# EAGLE board SparkFun_Thing_Plus_RA6M5 (EAGLE 9.6.2)
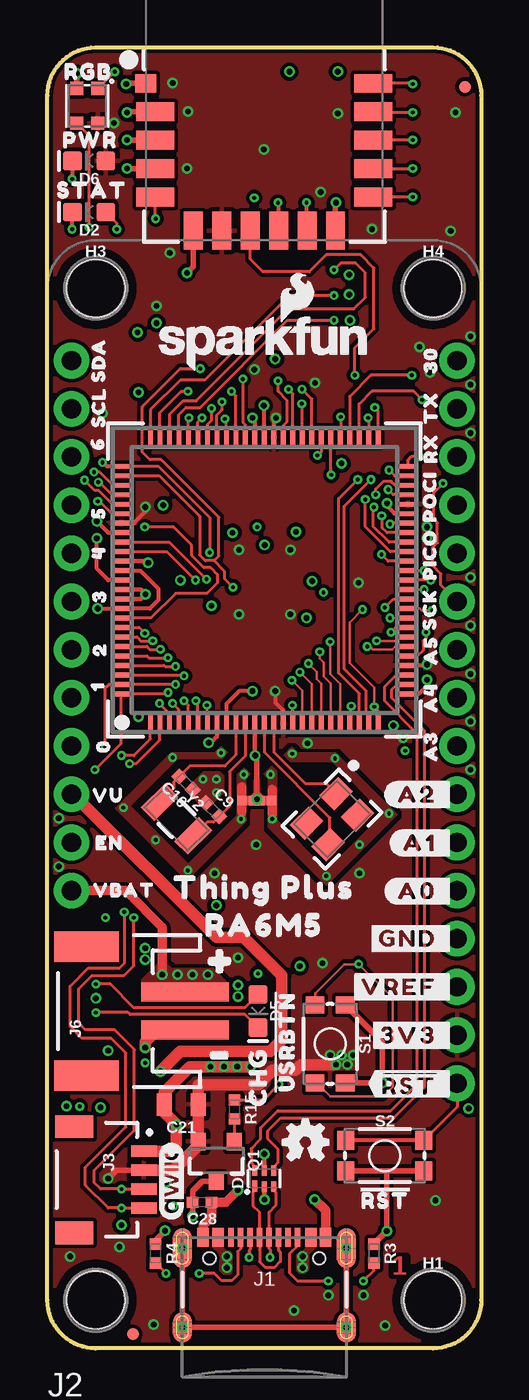
[diagram p2: board, top side]
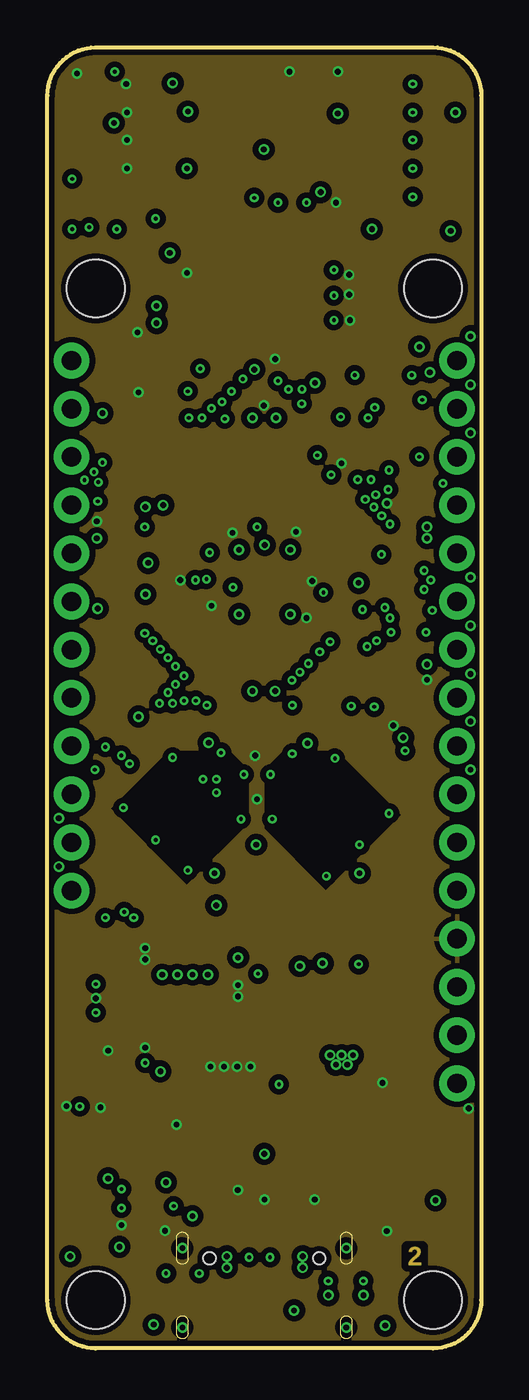
[diagram p3: board, inner layer Route2]
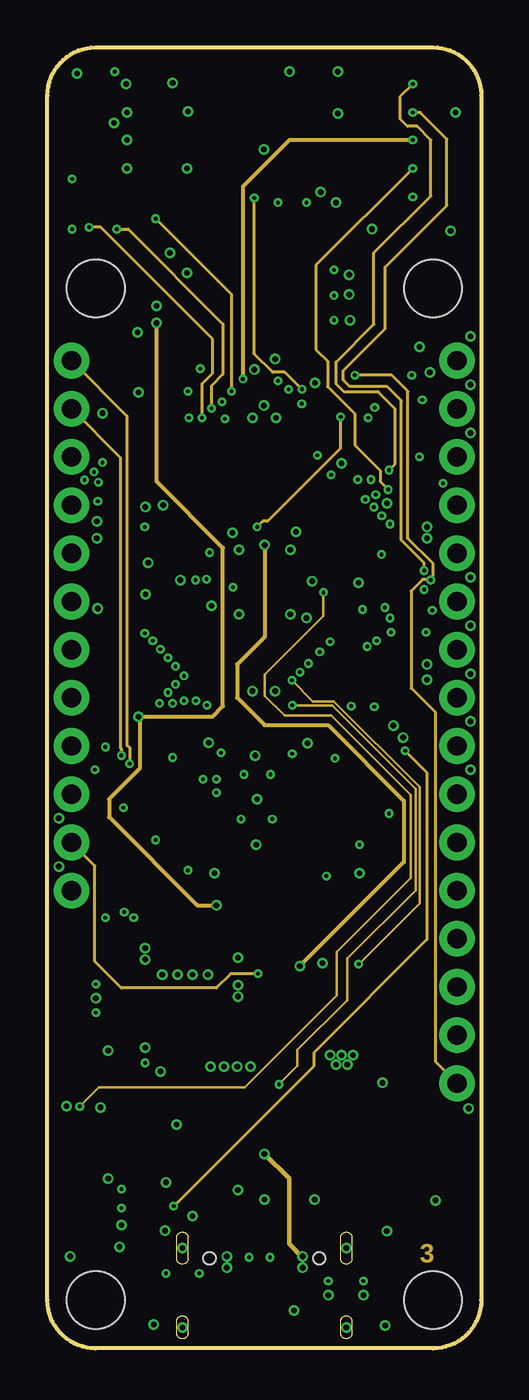
[diagram p4: board, inner layer Route3]
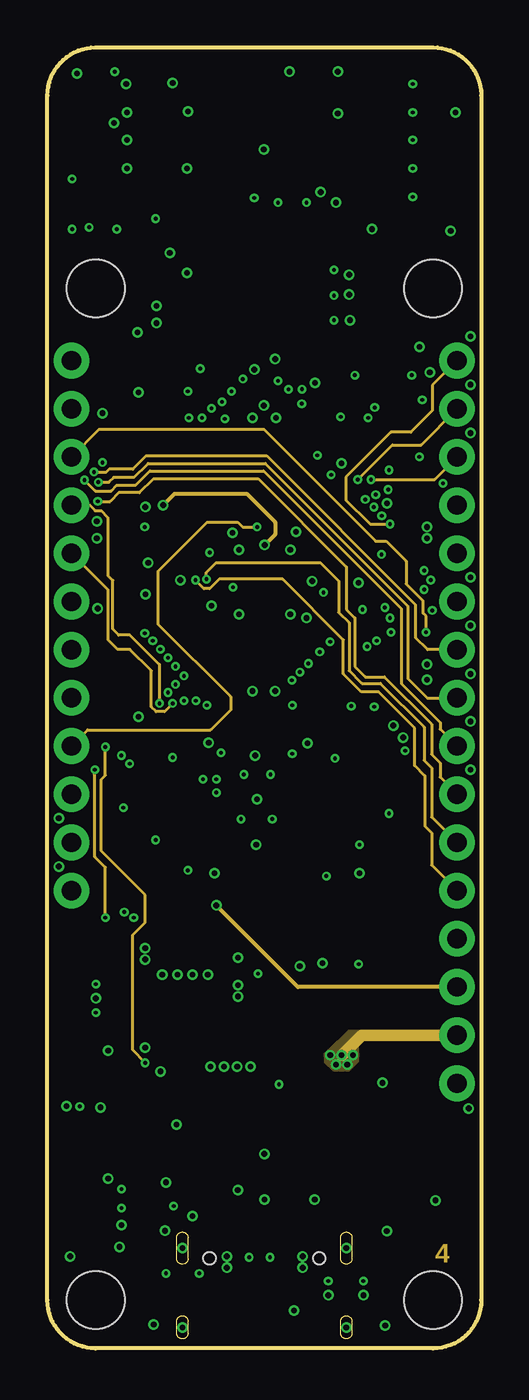
[diagram p5: board, inner layer Route14]
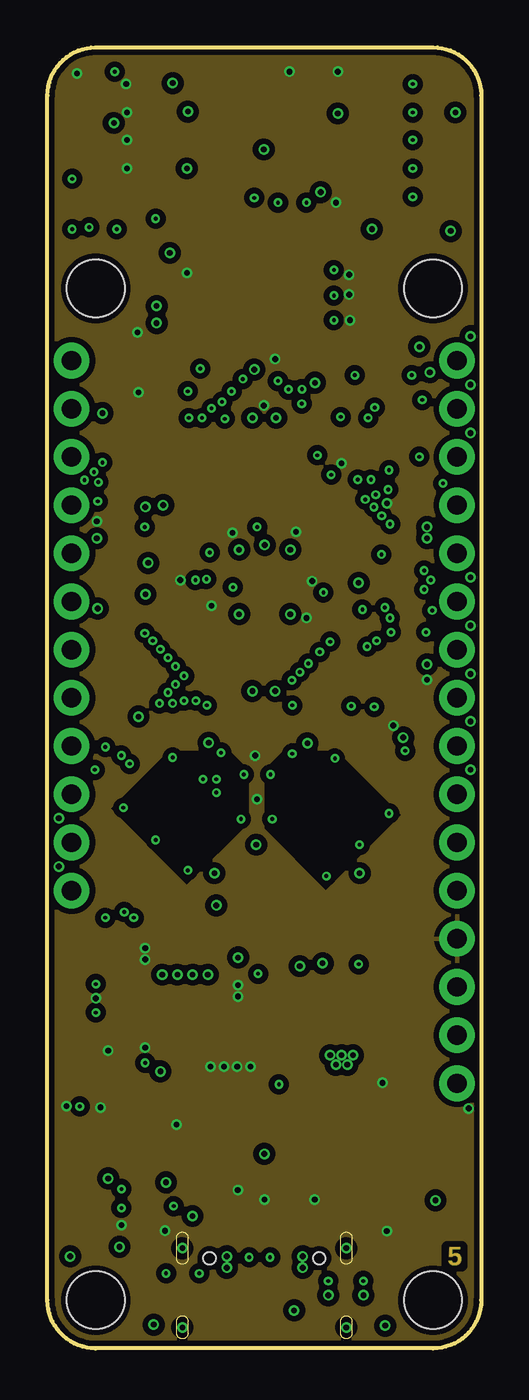
[diagram p6: board, inner layer Route15]
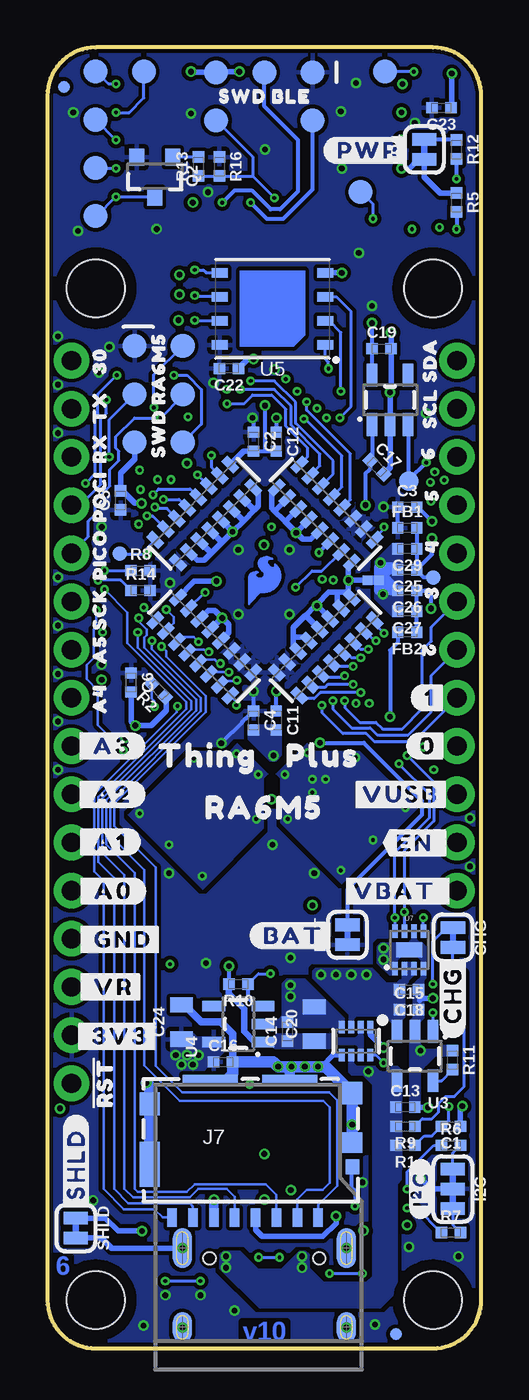
[diagram p7: board, bottom side, seen from below]

Size 22.86 x 68.58 mm. Coordinates in mm from the lower left corner, seen from the top.
Outline: 0,66.04 arc-90 2.54,68.58 20.32,68.58 arc-90 22.86,66.04 22.86,2.54 arc-90 20.32,0 2.54,0 arc-90 0,2.54 0,66.04
Copper layers (1+2*3+14*15+16): Top 0.035mm / dielectric 0.0994mm / Route2 0.0152mm / dielectric 0.55mm / Route3 0.0152mm / dielectric 0.1088mm / Route14 0.0152mm / dielectric 0.55mm / Route15 0.0152mm / dielectric 0.0994mm / Bottom 0.035mm
Design rules "SparkFun-6-Layer-Minimum-JLCPCB": minimum track width 0.09mm, minimum drill 0.2mm, track to track 0.09mm, track to pad 5mil, pad to pad 5mil, via to via 5mil, smd to smd 5mil, copper to edge 7mil, drill to drill 7mil, minimum pad ring 5mil, minimum via ring 5mil, stop-mask expansion 2.5mil, vias tented up to drill 25mil, thermal gap 10mil
Net classes: 2 CLK signals: width 0.15 mm, drill 0.2 mm, clearance 0.15 mm to class 0, clearance 0.15 mm to class 1, clearance 0.15 mm; 3 Analog Ground: width 0.2 mm, clearance 0.2 mm to class 1, clearance 0.3 mm to class 2; 4 Power: width 0.2 mm, drill 0.3 mm, clearance 0.2 mm to class 0, clearance 0.1 mm to class 1, clearance 0.15 mm to class 2, clearance 0.2 mm to class 3, clearance 0.2 mm; 5 USB diff: width 0.16 mm, drill 0.2 mm, clearance 0.3 mm to class 0, clearance 0.3 mm to class 1, clearance 0.3 mm to class 2, clearance 0.3 mm to class 3, clearance 0.2 mm to class 4, clearance 0.22 mm

## Footprints (pad centres in the part's own frame; a part is rotated, then mirrored left to right if it is on the bottom)
SMT-JUMPER_2_NC_TRACE_SILK = smd 0.66 x 1.27: 1 -0.521,0; 2 0.521,0
0402-TIGHT = smd 0.6 x 0.6: 1 -0.5,0; 2 0.5,0
0805 = smd 0.8 x 1.2: 1 -0.9,0; 2 0.9,0
SOT886 = smd 0.61 x 0.25: 1 -0.405,0.5 | smd 0.56 x 0.25: 2 -0.43,0; 3 -0.43,-0.5; 4 0.43,-0.5; 5 0.43,0; 6 0.43,0.5
LED-0603 = smd 1 x 1: A -0.877,0; C 0.877,0
WS2812-2020 = smd 0.7 x 0.7: DI -0.915,0.55; DO 0.915,-0.55; GND 0.915,0.55; VCC -0.915,-0.55
FIDUCIAL-MICRO = smd 0.635 x 0.635: 1 0,0
STAND-OFF-TIGHT = hole 3.048: 0,0
SMT-JUMPER_3_2-NC_TRACE_SILK = smd 0.66 x 1.27: 1 -1.041,0; 2 0,0; 3 1.041,0
USB-C-16P-6LAYER-ISOLATED = smd 0.3 x 1: A5 -1.25,-0.34; A6 -0.25,-0.34; A7 0.25,-0.34; A8 1.25,-0.34; B5 1.75,-0.34; B6 0.75,-0.34; B7 -0.75,-0.34; B8 -1.75,-0.34 | smd 0.6 x 1: GND -3.225,-0.34; GND2 3.225,-0.34; VBUS1 -2.45,-0.34; VBUS2 2.45,-0.34 | smd 1 x 2.1: SHLD1 -4.32,-0.915; SHLD2 4.32,-0.915 | smd 1 x 2.1 bottom: SHLD3 -4.32,-0.915; SHLD4 4.32,-0.915 | smd 1 x 1.6: SHLD5 -4.32,-5.095; SHLD8 4.32,-5.095 | smd 1 x 1.6 bottom: SHLD6 -4.32,-5.095; SHLD7 4.32,-5.095 | hole 0.65: -2.89,-1.445; 2.89,-1.445
THING_PLUS = drill 1.016 pad 1.88: 1 1.27,52.07; 2 1.27,49.53; 3 1.27,46.99; 4 1.27,44.45; 5 1.27,41.91; 6 1.27,39.37; 7 1.27,36.83; 8 1.27,34.29; 9 1.27,31.75; 10 1.27,29.21; 11 1.27,26.67; 12 1.27,24.13; 13 21.59,52.07; 14 21.59,49.53; 15 21.59,46.99; 16 21.59,44.45; 17 21.59,41.91; 18 21.59,39.37; 19 21.59,36.83; 20 21.59,34.29; 21 21.59,31.75; 22 21.59,29.21; 23 21.59,26.67; 24 21.59,24.13; 25 21.59,21.59; 26 21.59,19.05; 27 21.59,16.51; 28 21.59,13.97
JST04_1MM_RA = smd 0.6 x 1.35: 1 -1.5,0; 2 -0.5,0; 3 0.5,0; 4 1.5,0 | smd 1.2 x 2: NC1 2.8,-3.675; NC2 -2.8,-3.675
PAD_05_03X2_TP = smd 1.27 x 1.27: 1 -2.54,-1.27; 2 -2.54,1.27; 3 0,-1.27; 4 0,1.27; 5 2.54,-1.27; 6 2.54,1.27
PAD_05_03X2_TP_NO4 = smd 1.27 x 1.27: 1 -2.54,-1.27; 2 -2.54,1.27; 3 0,-1.27; 5 2.54,-1.27; 6 2.54,1.27
JST-2-SMD = smd 1 x 4.6: 1 -1,-3.7; 2 1,-3.7 | smd 1.6 x 3.4: NC1 -3.4,1.5; NC2 3.4,1.5
MICROSD_TINY = smd 0.5 x 1: 1 3.55,-3.85; 2 2.45,-3.85; 3 1.35,-3.85; 4 0.25,-3.85; 5 -0.85,-3.85; 6 -1.95,-3.85; 7 -3.05,-3.85; 8 -4.15,-3.85 | smd 0.72 x 0.78: 9 5.35,-1.17 | smd 1.05 x 1.08: GND1 5.35,0.1 | smd 1.05 x 1.2: GND2 5.35,2.71; GND3 -5.325,2.14 | smd 1.05 x 2.39: GND4 -5.325,-1.045 | smd 2.91 x 0.55: GND5 -2.145,3.385; GND6 2.045,3.385
SOT23-3 = smd 0.8 x 0.9: 1 -0.95,-1; 2 0.95,-1; 3 0,1.1
2506_AR = smd 0.45 x 0.9: 1 -2.8,-0.85; 2 -2,-0.85; 3 -1.2,-0.85; 4 -0.4,-0.85; 5 0.4,-0.85; 6 1.2,-0.85; 7 2,-0.85; 8 2.8,-0.85; 9 2.8,0.85; 10 2,0.85; 11 1.2,0.85; 12 0.4,0.85; 13 -0.4,0.85; 14 -1.2,0.85; 15 -2,0.85; 16 -2.8,0.85
TACTILE_SWITCH_SMD_4.6X2.8MM = smd 0.9 x 1: 1 -2.05,-0.8; 2 2.05,-0.8; 3 2.05,0.8; 4 -2.05,0.8
2PT_GND_TIE_SMALL = smd 0.5 x 0.5: P$1 0,0.3; P$2 0,-0.3
PAD.03X.05 = smd 1.27 x 1.27: 1 0,0
PAD.03X.04 = smd 1.016 x 1.016: 1 0,0
PAD.03X.03 = smd 0.762 x 0.762: 1 0,0
P-LQFP100-14X14-0.50 = smd 0.25 x 1.1: 1 -6,-7.55; 2 -5.5,-7.55; 3 -5,-7.55; 4 -4.5,-7.55; 5 -4,-7.55; 6 -3.5,-7.55; 7 -3,-7.55; 8 -2.5,-7.55; 9 -2,-7.55; 10 -1.5,-7.55; 11 -1,-7.55; 12 -0.5,-7.55; 13 0,-7.55; 14 0.5,-7.55; 15 1,-7.55; 16 1.5,-7.55; 17 2,-7.55; 18 2.5,-7.55; 19 3,-7.55; 20 3.5,-7.55; 21 4,-7.55; 22 4.5,-7.55; 23 5,-7.55; 24 5.5,-7.55; 25 6,-7.55; 51 6,7.55; 52 5.5,7.55; 53 5,7.55; 54 4.5,7.55; 55 4,7.55; 56 3.5,7.55; 57 3,7.55; 58 2.5,7.55; 59 2,7.55; 60 1.5,7.55; 61 1,7.55; 62 0.5,7.55; 63 0,7.55; 64 -0.5,7.55; 65 -1,7.55; 66 -1.5,7.55; 67 -2,7.55; 68 -2.5,7.55; 69 -3,7.55; 70 -3.5,7.55; 71 -4,7.55; 72 -4.5,7.55; 73 -5,7.55; 74 -5.5,7.55; 75 -6,7.55 | smd 1.1 x 0.25: 26 7.55,-6; 27 7.55,-5.5; 28 7.55,-5; 29 7.55,-4.5; 30 7.55,-4; 31 7.55,-3.5; 32 7.55,-3; 33 7.55,-2.5; 34 7.55,-2; 35 7.55,-1.5; 36 7.55,-1; 37 7.55,-0.5; 38 7.55,0; 39 7.55,0.5; 40 7.55,1; 41 7.55,1.5; 42 7.55,2; 43 7.55,2.5; 44 7.55,3; 45 7.55,3.5; 46 7.55,4; 47 7.55,4.5; 48 7.55,5; 49 7.55,5.5; 50 7.55,6; 76 -7.55,6; 77 -7.55,5.5; 78 -7.55,5; 79 -7.55,4.5; 80 -7.55,4; 81 -7.55,3.5; 82 -7.55,3; 83 -7.55,2.5; 84 -7.55,2; 85 -7.55,1.5; 86 -7.55,1; 87 -7.55,0.5; 88 -7.55,0; 89 -7.55,-0.5; 90 -7.55,-1; 91 -7.55,-1.5; 92 -7.55,-2; 93 -7.55,-2.5; 94 -7.55,-3; 95 -7.55,-3.5; 96 -7.55,-4; 97 -7.55,-4.5; 98 -7.55,-5; 99 -7.55,-5.5; 100 -7.55,-6
DA14531MOD = smd 1.1 x 1: 1 -6.25,1 | smd 2 x 1: 2 -5.75,-0.5; 3 -5.75,-2; 4 -5.75,-3.5; 5 -5.75,-5; 12 5.75,-5; 13 5.75,-3.5; 14 5.75,-2; 15 5.75,-0.5; 16 5.75,1 | smd 1 x 2: 6 -3.75,-6.75; 7 -2.25,-6.75; 8 -0.75,-6.75; 9 0.75,-6.75; 10 2.25,-6.75; 11 3.75,-6.75
SOT23-5 = smd 0.55 x 1.2: 1 -0.95,-1.3; 2 0,-1.3; 3 0.95,-1.3; 4 0.95,1.3; 5 -0.95,1.3
WSON-8-6X5 = smd 0.85 x 0.5: 1 -2.775,1.905; 2 -2.775,0.635; 3 -2.775,-0.635; 4 -2.775,-1.905; 5 2.775,-1.905; 6 2.775,-0.635; 7 2.775,0.635; 8 2.775,1.905
DFN-8 = smd 0.3 x 0.7: 1 -0.75,-0.99; 2 -0.25,-0.99; 3 0.25,-0.99; 4 0.75,-0.99; 5 0.75,0.99; 6 0.25,0.99; 7 -0.25,0.99; 8 -0.75,0.99 | smd 1.38 x 0.8: 9 0,0
SOT8 = smd 0.67 x 0.3: 1 -0.74,0.75; 2 -0.74,0.25; 3 -0.74,-0.25; 4 -0.74,-0.75; 5 0.74,-0.75; 6 0.74,-0.25; 7 0.74,0.25; 8 0.74,0.75
4-SMD,32X25 = smd 1.4 x 1.1: 1 -1.1,-0.8; 2 1.1,-0.8; 3 1.1,0.8; 4 -1.1,0.8
CRYSTAL-SMD-3.2X1.5MM = smd 1 x 1.8: P$1 -1.25,0; P$2 1.25,0

## Placement (x,y rotation side)
BAT  JUMPER-SMT_2_NC_TRACE_SILK  [SMT-JUMPER_2_NC_TRACE_SILK]  7.05,21.8 90 bottom
C1  1.0uF  [0402-TIGHT]  1.6,11.7 180 bottom
C2  0.1uF  [0402-TIGHT]  12,47.8 270 bottom
C3  0.1uF  [0402-TIGHT]  3.9,44.35 0 bottom
C4  0.1uF  [0402-TIGHT]  12,33.1 270 bottom
C5  0.1uF  [0402-TIGHT]  19,44.7 90 bottom
C6  0.1uF  [0402-TIGHT]  18.45,35.1 270 bottom
C9  9.1pF  [0402-TIGHT]  8.7,28.4 315 top
C10  9.1pF  [0402-TIGHT]  7.3,29.8 135 top
C11  0.1uF  [0402-TIGHT]  10.8,33.1 270 bottom
C12  0.1uF  [0402-TIGHT]  10.8,47.8 270 bottom
C13  2.2uF  [0402-TIGHT]  4.01,12.71 0 bottom
C14  2.2uF  [0402-TIGHT]  10.2,16.7 90 bottom
C15  2.2uF  [0402-TIGHT]  3.81,17.86 0 bottom
C16  2.2uF  [0402-TIGHT]  13.6,15.1 0 bottom
C17  2.2uF  [0402-TIGHT]  5.5,46.45 315 bottom
C18  0.1uF  [0402-TIGHT]  3.8,18.9 180 bottom
C19  1.0uF  [0402-TIGHT]  5.25,52.7 0 bottom
C20  10uF  [0805]  8.8,17.1 90 bottom
C21  10uF  [0805]  7.05,12.85 180 top
C22  0.1uF  [0402-TIGHT]  13.3,51.65 180 bottom
C23  0.1uF  [0402-TIGHT]  2.1,65.4 180 bottom
C24  47uF/6.3V  [0805]  15.8,17.2 90 bottom
C25  0.1uF  [0402-TIGHT]  3.9,41.05 180 bottom
C26  0.1uF  [0402-TIGHT]  3.9,39.95 180 bottom
C27  1.0uF  [0402-TIGHT]  3.9,38.85 180 bottom
C28  0.1uF  [0402-TIGHT]  8.15,7.7 180 top
C29  1.0uF  [0402-TIGHT]  3.9,42.15 180 bottom
CHG  JUMPER-SMT_2_NC_TRACE_SILK  [SMT-JUMPER_2_NC_TRACE_SILK]  1.49,21.66 270 bottom
D1  PRTR5V0U2F  [SOT886]  11.43,8.95 90 top
D2  BLUE  [LED-0603]  2.2,59.9 180 top
D4  WS2812_2020  [WS2812-2020]  2.1,65.5 90 top
D5  Yellow  [LED-0603]  11.1,17.78 270 top
D6  [LED-0603]  2.2,62.6 180 top
FB1  120-OHM  [0402-TIGHT]  3.9,43.25 0 bottom
FB2  120-OHM  [0402-TIGHT]  3.9,37.75 180 bottom
FD1  FIDUCIALUFIDUCIAL  [FIDUCIAL-MICRO]  22,66.5 0 top
FD2  FIDUCIALUFIDUCIAL  [FIDUCIAL-MICRO]  4.5,0.75 0 bottom
FD3  FIDUCIALUFIDUCIAL  [FIDUCIAL-MICRO]  22,66.5 0 bottom
FD4  FIDUCIALUFIDUCIAL  [FIDUCIAL-MICRO]  4.5,0.75 0 top
FRAME1  FRAME-LEDGER  [CREATIVE_COMMONS]  53.84,2.06 0 top  (outside the outline)
FRAME2  FRAME-LEDGERNO_FOOTPRINT  [DUMMY]  24.28,1.89 0 top
H1  STAND-OFFTIGHT  [STAND-OFF-TIGHT]  20.32,2.54 0 top
H2  STAND-OFFTIGHT  [STAND-OFF-TIGHT]  2.54,2.54 0 top
H3  STAND-OFFTIGHT  [STAND-OFF-TIGHT]  2.54,55.88 0 top
H4  STAND-OFFTIGHT  [STAND-OFF-TIGHT]  20.32,55.88 0 top
I2C  JUMPER-SMT_3_2-NC_TRACE_SILK  [SMT-JUMPER_3_2-NC_TRACE_SILK]  1.5,8.4 270 bottom
J1  USB Female Type C Connector  [USB-C-16P-6LAYER-ISOLATED]  11.43,6.2 0 top
J2  THING_PLUS_LOGICAL  [THING_PLUS]  0,0 0 top
J3  QWIIC_RA  [JST04_1MM_RA]  5.08,8.89 270 top
J4  CONN_03X2  [PAD_05_03X2_TP]  17,50.3 270 bottom
J5  [PAD_05_03X2_TP_NO4]  11.43,66 180 bottom
J6  [JST-2-SMD]  3.56,17.78 90 top
J7  MICRO-SDFRICTION  [MICROSD_TINY]  12.14,10.74 0 bottom
JP4  JUMPER-SMT_2_NC_TRACE_SILK  [SMT-JUMPER_2_NC_TRACE_SILK]  3,63.2 90 bottom
LOGO1  OSHW-LOGOMINI  [OSHW-LOGO-MINI]  13.6,10.88 0 top
LOGO2  SFE_LOGO_NAME_FLAME.1_INCH  [SFE_LOGO_NAME_FLAME_.1]  11.43,53 0 top
LOGO3  QWIIC_LOGO_4MM  [QWIIC_4MM]  6.54,8.82 90 top
LOGO4  SFE_LOGO_NAME_FLAMEBLANK  [BLANK]  23.26,0.88 0 top
Q1  20V/4.2A/52mΩ/1.4W  [SOT23-3]  8.9,9.9 180 top
Q2  20V/4.2A/52mΩ/1.4W  [SOT23-3]  17.2,61.8 180 bottom
R1  1k  [0402-TIGHT]  4,10.7 180 bottom
R2  20k  [0402-TIGHT]  17,34.7 135 bottom
R3  5.1k  [0402-TIGHT]  17.2,5 270 top
R4  5.1k  [0402-TIGHT]  5.7,5 270 top
R5  2.2k  [0402-TIGHT]  1.3,60.4 270 bottom
R6  2.2k  [0402-TIGHT]  1.6,10.7 0 bottom
R7  2.2k  [0402-TIGHT]  1.6,6.1 0 bottom
R8  10k  [0402-TIGHT]  17.95,41 0 bottom
R9  4.7k  [0402-TIGHT]  4,11.7 180 bottom
R10  1M  [0402-TIGHT]  12.8,19.2 180 bottom
R11  4.7k  [0402-TIGHT]  1.52,15.19 270 bottom
R12  4.7k  [0402-TIGHT]  1.3,63.2 270 bottom
R13  1k  [0402-TIGHT]  14.9,62.3 90 bottom
R14  10k  [0402-TIGHT]  17.95,39.95 0 bottom
R15  1k  [0402-TIGHT]  9.85,12.6 270 top
R16  10k  [0402-TIGHT]  13.8,62.3 270 bottom
RN1  10K  [2506_AR]  8.2,44 315 bottom
RN3  10K  [2506_AR]  14.6,37 135 bottom
RN4  10K  [2506_AR]  14.6,44 45 bottom
RN5  10K  [2506_AR]  8.2,37 45 bottom
S1  USER  [TACTILE_SWITCH_SMD_4.6X2.8MM]  14.9,16.05 270 top
S2  RESET  [TACTILE_SWITCH_SMD_4.6X2.8MM]  17.78,10.16 0 top
SHLD  JUMPER-SMT_2_NC_TRACE_SILK  [SMT-JUMPER_2_NC_TRACE_SILK]  21.36,6.34 270 bottom
SUPPLYTIE1  2PT_GND_TIESMALL  [2PT_GND_TIE_SMALL]  5.7,40.5 270 bottom
SUPPLYTIE2  2PT_GND_TIESMALL  [2PT_GND_TIE_SMALL]  10.56,28.87 90 top
SUPPLYTIE3  2PT_GND_TIESMALL  [2PT_GND_TIE_SMALL]  11.5,28.87 90 top
TP1  TEST-POINT3X5  [PAD.03X.05]  5.08,67.31 0 bottom
TP2  TEST-POINT3X4  [PAD.03X.04]  3.81,45.72 90 bottom
TP3  TEST-POINT3X5  [PAD.03X.05]  20.32,59.69 0 bottom
TP4  TEST-POINT3  [PAD.03X.03]  2.54,40.64 0 bottom
TP5  TEST-POINT3X5  [PAD.03X.05]  20.32,64.77 0 bottom
TP6  TEST-POINT3X5  [PAD.03X.05]  6.35,60.96 0 bottom
TP7  TEST-POINT3X5  [PAD.03X.05]  20.32,62.23 0 bottom
TP8  TEST-POINT3X5  [PAD.03X.05]  20.32,67.31 0 bottom
TP9  TEST-POINT3  [PAD.03X.03]  19.05,41.91 0 bottom
TP10  TEST-POINT3X5  [PAD.03X.05]  17.78,67.31 0 bottom
U1  R7FA6M5  [P-LQFP100-14X14-0.50]  11.43,40.5 0 top
U2  DA14531MOD  [DA14531MOD]  11.43,65.68 0 top
U3  MCP73831  [SOT23-5]  3.5,15.41 180 bottom
U4  RT9080-33GJ5  [SOT23-5]  12.8,17.1 90 bottom
U5  MX25L12833F 128Mb  [WSON-8-6X5]  11,54.8 180 bottom
U6  RT9080-33GJ5  [SOT23-5]  4.8,50 0 bottom
U7  MAX17048  [DFN-8]  3.8,21 0 bottom
U8  LM66200  [SOT8]  6.6,16.2 270 bottom
U$3  [#I�C#0]  3.2,8.4 90 bottom
U$4  [#CHG#0]  1.5,18.6 90 bottom
U$8  [SFE_LOGO_FLAME_COPPER_EXPOSED_.1]  11.43,40.5 0 bottom
U$9  [SWD_RA6M50]  17,50.25 90 bottom
U$10  [SWD_BLE0]  11.4,66 0 bottom
U$12  [300]  20.2,52.1 90 top
U$13  [#RST#0]  17.8,7.9 0 top
U$14  [CHG0]  11.1,14.3 90 top
U$15  [STAT0]  2.35,61.05 0 top
U$16  [PWR0]  2.25,63.7 0 top
U$17  [RGB0]  2.15,67.3 0 top
U$18  [THING_PLUS0]  11.43,24.3 0 top
U$19  [##RST#_#0]  21.55,13.95 0 top
U$20  [#3V3_#0]  21.55,16.5 0 top
U$21  [#VREF_#0]  21.55,19.05 0 top
U$22  [#GND_#0]  21.55,21.6 0 top
U$23  [#A0_#0]  21.55,24.1 0 top
U$24  [#A1_#0]  21.55,26.65 0 top
U$25  [#A2_#0]  21.55,29.2 0 top
U$26  [A30]  20.2,31.75 90 top
U$27  [A40]  20.2,34.3 90 top
U$28  [A50]  20.2,36.8 90 top
U$29  [SCK0]  20.15,38.95 90 top
U$30  [PICO0]  20.15,41.85 90 top
U$31  [POCI0]  20.15,44.9 90 top
U$32  [RX0]  20.2,47.45 90 top
U$33  [TX0]  20.2,49.6 90 top
U$34  [60]  2.65,47.7 90 top
U$35  [SDA0]  2.7,52.1 90 top
U$36  [SCL0]  2.7,49.6 90 top
U$37  [50]  2.7,44.05 90 top
U$38  [40]  2.7,41.95 90 top
U$39  [30]  2.75,39.65 90 top
U$40  [20]  2.75,36.85 90 top
U$41  [10]  2.65,34.9 90 top
U$42  [00]  2.95,31.75 90 top
U$43  [60]  2.8,47.2 90 bottom
U$44  [VU0]  3.2,29.15 0 top
U$45  [EN0]  3.25,26.65 0 top
U$46  [VBAT0]  4.05,24.15 0 top
U$47  [#PWR#0]  5.95,63.15 0 bottom
U$48  [50]  2.6,45 90 bottom
U$49  [#BAT#0]  9.9,21.75 0 bottom
U$50  [#SHLD#0]  21.35,9.7 90 bottom
U$51  [#RST#0]  19.95,14 90 bottom
U$52  [#_3V3#0]  19.2,16.45 0 bottom
U$53  [#_VR#0]  21.45,19.05 0 bottom
U$54  [#_GND#0]  19.05,21.55 0 bottom
U$55  [#_A0#0]  19.55,24.1 0 bottom
U$56  [#_A1#0]  19.7,26.7 0 bottom
U$57  [#_A2#0]  19.6,29.2 0 bottom
U$58  [#_A3#0]  19.6,31.75 0 bottom
U$59  [A40]  20.1,34.25 90 bottom
U$60  [A50]  20.1,36.85 90 bottom
U$61  [SCK0]  20.1,38.95 90 bottom
U$62  [PICO0]  20.1,41.85 90 bottom
U$63  [POCI0]  20.1,44.9 90 bottom
U$64  [RX0]  20.1,47.45 90 bottom
U$65  [TX0]  20.1,49.6 90 bottom
U$66  [40]  2.6,42.3 90 bottom
U$67  [SDA0]  2.7,52.1 90 bottom
U$68  [SCL0]  2.7,49.55 90 bottom
U$69  [30]  2.6,39.85 90 bottom
U$70  [20]  2.75,36.75 270 bottom
U$71  [#1#0]  2.7,34.3 0 bottom
U$72  [#0#0]  2.8,31.75 0 bottom
U$73  [#USRBTN#0]  12.5,16.15 90 top
U$76  [#VUSB#0]  4.25,29.2 0 bottom
U$77  [#EN_#0]  3.35,26.65 0 bottom
U$78  [#VBAT_#0]  4.4,24.1 0 bottom
U$79  [RA6M50]  11.43,22.3 0 top
U$80  [ORDERING_INSTRUCTIONS]  27.95,68.2 0 top  (outside the outline)
U$81  [#0]  9.2,20.4 0 top
U$82  [RA6M50]  11.43,28.5 0 bottom
U$83  [THING0]  14.4,31.25 0 bottom
U$84  [PLUS0]  8.35,31.25 0 bottom
U$85  [_#0]  8.85,15.45 0 top
U$86  [300]  20.1,52.05 90 bottom
Y1  24.000MHz  [4-SMD,32X25]  15,27.9 225 top
Y2  32.768kHz  [CRYSTAL-SMD-3.2X1.5MM]  6.8,27.9 315 top

## Tracks (layer width: path | path; a pad name or v marks a point on that pad's centre or on a via)
3.3V  (via drill 0.3)
  Top 0.2: 11.93,48.95 U1.62 | v20,36.05 19.95,36 U1.29 | U1.82 4.55,43.5 5.16,44.11 v5.16,44.35 | U1.15 12.43,33.63 12.03,34.03 12.03,34.62 v12,34.65
  Top 0.3: J3.2 3.64,9.39 v3.2,8.95
  Top 0.6: J3.2 6.64,9.39 7.95,10.7 Q1.2 C21.1 7.95,13.9 11.1,13.9 11.85,14.65 13.05,14.65 13.35,14.95 v15.2,14.95
  Route14 0.6: J2.27 16.56,16.51 v15.5,15.45
  Bottom 0.2: v12,34.65 C4.1 12.4,33.2 12.42,33.2 12.6,33.02 12.6,33 v13.7,31.9 | C2.1 12,49.02 | FB1.1 C3.1
  Bottom 0.3: v3.2,8.95 2.65,8.4 I2C.2
  other vias: 14.9,15.45 16.1,15.45 15.8,14.95 3.5,64.6 12.05,49.05 20,43.3 10.1,42.1 12.8,42.1 12.8,38.7 10.1,38.7 16.4,40.35 18.75,32.2 14.1,50.9 19.6,52.8 11,26.55 16.45,25.05 8.8,25.05 14.5,20.3 10.9,51.6 5.75,54.95 7.4,65.2 6.6,66.7 7.35,62.2 15.3,65.1 11.4,63.2 14.4,60.95 17.1,59 21.25,58.9 21.5,65.15 6.45,57.75 13,2 14.8,2.8 16.65,2.8 5.6,1.25 3.8,5.35 1.2,4.85 17.8,1.2 6.25,8.75 20.45,7.8 22.3,33.05 22.3,30.5 22.3,35.55 22.3,38.1 22.3,40.65 20,42.7 22.3,48.25 22.3,50.8 20.15,51.45 22.3,53.35 2.9,49.3 0.6,25.4 0.6,27.95 10.05,20.6
  pour Bottom (isolate 0.15, rank 2, no thermals): 13.8,14.85 13.85,14.8 14.4,14.8 14.6,14.6 16,14.6 16.4,15 16.4,16.6 16.35,16.65 15.2,16.65 15,16.45 13.55,16.45 13.5,16.4 13.5,15.65 13.8,15.35
  pour Top (isolate 0.2, rank 3): 0,0 22.85,0 22.85,68.6 0,68.6
  pour Bottom (isolate 0.2, rank 3): 0,0 22.85,0 22.85,68.6 0,68.6
  pour Route14 (no thermals): 16.65,16.8 15.85,16.8 14.7,15.65 14.6,15.55 14.6,15.3 14.6,15.05 15,14.65 15.05,14.6 15.9,14.6 16.4,15.1 16.4,15.3 16.4,15.95 16.65,16.2
  pour Top: 16.4,59.75 16.3,59.75 15.9,60.15 15.9,60.25 15.75,60.25 16,60 16,59.85 16.25,59.6
  pour Top: 6.6,59.85 6.75,59.85 6.95,60.05 6.95,60.25 7.15,60.25 7.15,60.15 6.8,59.8 6.65,59.8
3.3V_SW  (via drill 0.3)
  Top 0.3: v7.65,6.97 C28.2 7.65,8.3 8.15,8.8 Q1.3
  Bottom 0.3: J7.4 11.89,6.24 11.54,5.89 8.35,5.89 7.65,6.59 v7.65,6.97
!CTS_RA6/RTS_DA14531!  (via drill 0.2)
  Top 0.15: U2.13 19.23,62.18 v19.25,62.2 | U1.47 18.22,45 v17.95,45.27
  Route3 0.15: v19.25,62.2 14.15,57.1 14.15,52.65 14.77,52.03 14.77,50.69 16.2,49.26 16.2,47.61 17.53,46.28 17.53,45.69 v17.95,45.27
  Bottom 0.15: v19.25,62.2 20.29,62.2 TP7.1
!DA14531_RST!  (via drill 0.2)
  Top 0.15: U1.58 13.93,50.04 v13.41,50.56
  Route3 0.15: v13.41,50.56 12.51,51.46 11.86,51.46 10.9,52.42 v10.9,60.65
  Bottom 0.15: J5.6 12.05,62.81 12.05,61.8 | R13.1 R16.2 12.05,61.8 | 12.05,61.8 v10.9,60.65
!FG_ALRT!  (via drill 0.2)
  Top 0.15: v6.35,34.57 6.28,34.5 U1.100 3.88,31.88 v2.5,30.5
  Route14 0.15: v3.05,22.7 3.05,25.36 2.5,25.91 v2.5,30.5
  Bottom 0.15: U7.5 v3.05,22.7 | RN5.1 9.41,34.25 8.8,34.25 8.48,34.57 v6.35,34.57
!NMI!  (via drill 0.2)
  Top 0.15: U1.40 17.95,41.5 v17.6,41.85
  Bottom 0.15: RN4.16 17.6,42.2 v17.6,41.85 v17.61,41.86 19,41.86 TP9.1
!QCS!  (via drill 0.2)
  Top 0.15: U1.77 5.89,46 8.02,43.87 8.02,41.82 8.32,41.52 8.78,41.52 | v8.05,51.65 7.01,51.65 5,49.64 5,47.25 5.4,46.85 6,46.85 9.03,43.82 9.03,41.77 8.78,41.52 | v9.78,40.12 9.33,40.57 9.33,40.97 8.78,41.52
  Bottom 0.15: RN1.7 8.39,40.98 8.91,40.98 9.77,40.12 v9.78,40.12 | v8.05,51.65 8.05,52 8.22,52.17 U5.1
!RA6M5_RESET!  (via drill 0.2)
  Top 0.15: v20.2,40.5 U1.38 | v16.2,51.3 16.2,52.75 17.2,53.75 17.2,56.95 16.5,57.65 14.7,57.65 13.8,56.75 11.35,56.75 10.68,57.42 U2.8 | J2.28 21.59,12.72 S2.3
  Top 0.2: S2.3 S2.4
  Route3 0.15: J2.28 20.45,15.11 20.45,33.52 19.17,34.8 19.17,39.93 19.77,40.53 20.17,40.53 v20.2,40.5 20.26,40.5 20.33,40.57 20.33,41.37 19,42.7 19,50.45 18.15,51.3 v16.2,51.3
  Bottom 0.15: R14.1 19,40.5 v20.2,40.5 | v16.2,51.3 15.5,51.3 14.74,50.55 14.74,48.72 15.71,47.76 J4.6
!RTS_RA6/CTS_DA14531!  (via drill 0.2)
  Top 0.15: v19.25,66.65 19.22,66.68 U2.16 | U1.49 18.3,46 v18,46.3
  Route3 0.15: v19.25,66.65 18.57,65.97 18.57,64.82 18.97,64.42 19.48,64.42 20.2,63.7 20.2,60.75 17.2,57.75 17.2,53.99 15.21,52 15.21,50.84 15.64,50.41 17.44,50.41 18.3,49.55 18.3,46.6 v18,46.3
  Bottom 0.15: TP8.1 19.67,66.67 19.27,66.67 v19.25,66.65
!SD_EN!  (via drill 0.2)
  Top 0.15: R15.1 11.39,13.1 v12.2,13.91 | U1.16 12.93,33.88 v12.91,33.9
  Route3 0.12: v12.91,33.9 15,33.9 19.4,29.5 19.4,24.15 15.8,20.55 15.8,18.35 13.18,15.72 13.18,14.89 v12.2,13.91
  Bottom 0.15: v12.91,33.9 12.91,34.1 RN3.16
!USR_BTN!  (via drill 0.2)
  Top 0.12: U1.17 13.43,34.67 v12.88,35.22 | S1.1 14.1,18.7 15.65,20.25 v16.4,20.25 16.42,20.25 18.19,18.48 18.19,13.78 17.7,13.29 14.89,13.29 14.18,14 S1.2
  Route3 0.12: v12.88,35.22 13.99,34.11 15.09,34.11 19.61,29.59 19.61,23.46 v16.4,20.25
  Bottom 0.12: v12.88,35.22 12.93,35.17 13.6,35.17 RN3.15
A0/DAC0/D7  (via drill 0.2)
  Top 0.15: U1.85 6.3,42 v7.8,40.5
  Route14 0.15: J2.24 20.24,25.48 20.24,27.18 19.89,27.53 19.89,30.18 19.35,30.72 19.35,32.7 17.45,34.6 16.55,34.6 15.6,35.55 15.6,37.35 12.4,40.55 9.05,40.55 8.55,40.05 8.25,40.05 v7.8,40.5
A1/DAC1/D8  (via drill 0.2)
  Top 0.15: U1.84 6.41,42.5 8.36,40.55 v8.38,40.55
  Route14 0.15: v8.38,40.55 8.38,40.9 8.88,41.4 14.4,41.4 15.35,40.45 15.35,38.8 15.9,38.25 15.9,35.73 16.57,35.05 17.55,35.05 19.85,32.75 19.85,31 20.25,30.6 20.25,28.01 J2.23
A2/D9  (via drill 0.2)
  Top 0.15: U1.81 3.4,44 2.75,44.65 v2.65,44.65
  Route14 0.15: v2.65,44.65 3.3,44.65 3.75,45.1 4.85,45.1 5.6,45.85 11.1,45.85 15.75,41.2 15.75,38.95 16.2,38.5 16.2,35.95 16.75,35.4 17.75,35.4 20.24,32.91 20.24,31.31 20.69,30.86 20.69,30.11 J2.22
A3/D10  (via drill 0.2)
  Top 0.15: U1.80 3.42,44.5 2.7,45.22 2.5,45.22 v1.95,45.77
  Route14 0.15: v1.95,45.77 2.52,45.2 3.35,45.2 3.65,45.5 4.65,45.5 5.4,46.25 11.39,46.25 18.65,38.99 18.65,35.04 20.69,33 20.69,32.65 J2.21
A4/D11  (via drill 0.2)
  Top 0.15: U1.79 3.39,45 2.73,45.66 v2.68,45.66
  Route14 0.15: v2.68,45.66 3.23,45.66 3.48,45.91 4.56,45.91 5.3,46.65 11.48,46.65 19,39.13 19,35.3 20.01,34.29 J2.20
A5/D12  (via drill 0.2)
  Top 0.15: U1.78 3.45,45.5 2.75,46.2 v2.45,46.2
  Route14 0.15: v2.45,46.2 3.1,46.2 3.25,46.35 4.5,46.35 5.2,47.05 11.55,47.05 19.39,39.21 19.39,37.48 20.04,36.83 J2.19
AGND  (via drill 0.3)
  Top 0.25: U1.89 4.92,40 v5.17,39.75 v5.17,39.74 4.93,39.5 U1.90 | U1.86 5.22,41.5 v5.31,41.41
  Bottom 0.5: SUPPLYTIE1.P$1 5.4,39.95 5.05,39.95 | 5.05,39.95 C26.2 4.95,40.5 SUPPLYTIE1.P$1 | SUPPLYTIE1.P$1 5.4,41.15 5.35,41.2 4.55,41.2 C25.2 4.85,41.05 SUPPLYTIE1.P$1 | SUPPLYTIE1.P$1 5.05,40.15 5.05,39.95
  pour Bottom (no thermals): 4.1,38.6 4.15,38.55 4.7,38.55 5.65,39.5 5.65,41.5 4.7,42.45 4.15,42.45 4.1,42.4
AVCC0  (via drill 0.3)
  Top 0.2: U1.88 3.2,40.5 2.6,41.1 v2.6,42.7
  Bottom 0.2: FB1.2 C29.1 C25.1 | C25.1 2.6,41.85 v2.6,42.7 | TP4.1 3.04,40.64 3.4,41 C25.1
BAT_SW  (via drill 0.2)
  Top 0.15: v6.75,35 U1.99 3.25,35 3.05,34.8 v3.05,31.7
  Route14 0.15: v5.15,15.05 v5.16,15.06 4.5,15.72 4.5,21.8 5.15,22.45 5.15,23.9 2.84,26.21 2.84,30 3.05,30.21 v3.05,31.7
  Bottom 0.15: U8.8 5.56,15.46 v5.15,15.05 | RN5.2 8.88,34.85 8.23,34.85 8.08,35 v6.75,35
BLE_RST  (via drill 0.2)
  Top 0.15: v19.25,60.7 19.23,60.68 U2.12
  Bottom 0.15: TP3.1 20.27,59.69 v19.26,60.7 v19.25,60.7 Q2.3
BOOT/MD  (via drill 0.2)
  Top 0.15: U1.39 v19.85,41 | v19.25,65.15 17.21,65.15 U2.15
  Route3 0.15: v19.85,41 19.85,41.4 18.65,42.6 18.65,49.95 17.9,50.7 15.94,50.7 15.6,51.04 15.6,51.55 17.8,53.75 17.8,57 21.05,60.25 21.05,63.75 19.65,65.15 v19.25,65.15
  Bottom 0.15: v19.85,41 R8.1 | v19.25,65.15 18.55,65.15 17.78,65.92 TP10.1
DA14531_SWCLK  (via drill 0.2)
  Top 0.2: U2.10 13.65,58.96 v13.65,60.4
  Bottom 0.2: v13.65,60.4 13,61.05 12.1,61.05 11.1,60.05 10.6,60.05 9.65,61 9.65,63.7 11.43,65.48 J5.3
DA14531_SWDIO  (via drill 0.2)
  Top 0.2: U2.9 12.18,60.37 v12.15,60.4
  Bottom 0.2: v12.15,60.4 11.3,59.55 10.44,59.55 8.89,61.1 J5.2
EXTAL
  Top 0.15: U1.14 11.93,31.43 13.59,29.77 14.69,29.77 Y1.1
FREE/D30  (via drill 0.2)
  Top 0.15: U1.44 18.1,43.5 v18.05,43.45
  Route14 0.15: J2.13 20.29,50.77 20.29,49.44 19.15,48.3 18.1,48.3 15.73,45.93 15.73,44.73 17,43.45 v18.05,43.45
GND  (via drill 0.3)
  Top 0.2: v2.6,43.6 3.2,43 U1.83 | v17.9,44.55 17.9,44.4 18.3,44 U1.45 | v11.4,49.7 11.43,49.67 U1.63 | v20,35.25 20,34.92 19.58,34.5 U1.26
  Top 0.25: D1.2 v11.43,7.84 | U1.12 10.93,31.27
  Top 0.3: v6.2,6.2 5.7,5.7 R4.1 | S2.1 17.9,9.36 | 17.9,9.36 S2.2 | R3.1 v17.88,6.18 v17.88,6.19 17.88,9.34 17.9,9.36 | v1.55,67.2 D4.GND | U2.1 4.18,66.68 v4.15,66.65 | U2.2 4.23,65.18 v4.2,65.15 | U2.3 4.22,63.68 v4.2,63.7 | U2.4 4.22,62.18 v4.2,62.2 | U2.6 7.68,57.03 v7.35,56.7 | U2.11 15.18,60.38 v15.2,60.4 | 11.03,29.37 11.03,31.17 v10.95,31.25 10.93,31.27 | SUPPLYTIE2.P$2 10.94,28.95 v11.05,28.95 | S1.3 v17.65,14 17.65,16.15 S1.4
  Top 0.5: 11,29.11 10.86,28.97 SUPPLYTIE2.P$2 SUPPLYTIE3.P$1 11.2,28.97 11.07,29.1 | J1.GND 8.21,6.5 8.65,6.94 C28.1 9.4,7.7 v10.03,8.34 | J1.GND2 14.65,7.26 v14.08,7.84
  Top 0.6: J3.1 6.44,10.39 6.8,10.75 v6.8,11.8 6.15,12.45 C21.2 | C21.2 6.15,12.75 | C21.2 6.15,13.5 7.5,14.85 v8.6,14.85 v9.3,14.85 v10,14.85 v10.7,14.85 | v5.15,15.85 5.15,16.15 5.78,16.78 J6.1
  Bottom 0.2: v2.6,43.6 3.35,44.35 C3.2 | v11.4,49.7 11.4,47.3 | 11.4,47.3 C12.2 | C2.2 11.4,47.3 | 13.94,67.3 J5.5
  Bottom 0.3: C13.2 3.49,12.7 v2.8,12.7 | C1.1 1.1,12.67 v1,12.77 | v2.55,18.45 3.15,18.45 3.25,18.35 | v14.08,7.84 14.09,7.83 | SHLD.1 19.81,6.86 19.14,6.19 v17.88,6.19 | v5.15,15.85 5.85,16.55 U8.1 | U8.5 7.79,15.46 8.4,14.85 v8.6,14.85 | SUPPLYTIE1.P$2 v7,40.5 | v7,40.5 7,41.24 RN1.8 | v7,40.5 7,39.76 RN5.9 7.11,39.87 7.6,39.87 | v17.9,44.55 18.25,44.55 18.9,45.2 C5.2 19,46.15 18.27,46.88 J4.5 | C6.2 18.45,33.05 v18.23,32.83 18.21,32.84 17.38,32.84 16.6,33.63 16.6,34.3 R2.1 | RN3.5 13.67,38.5 v13.65,38.5 | RN3.8 15.11,40.45 v13.95,40.45 | RN1.5 8.98,42.65 9.4,42.65 v9.75,43 | RN1.4 9.75,43.02 v9.75,43 | R5.1 2.15,60.9 3,61.75 JP4.1 3.32,62.68 3.8,62.2 v4.2,62.2 | C23.1 1.55,65.45 v1.55,67.2 | v7.35,56.7 v7.36,56.7 U5.4 | v9.75,43 10.35,43.6 | 10.35,43.6 10.95,44.2 | 10.95,44.2 11.05,44.3 11.05,45.11 RN1.1 | RN1.2 10.83,44.2 10.95,44.2 | RN1.3 10.3,43.6 10.35,43.6 | 12.4,44.63 RN4.7 11.97,44.2 11.95,44.2 | RN4.5 13.1,43.07 | 13.1,43.07 v13.1,43.05 13.65,42.5 | 12.5,43.65 13.08,43.07 13.1,43.07 | RN4.6 12.55,43.65 12.5,43.65 | 14.22,41.92 14.6,41.55 14.98,41.55 RN4.2 | 14.22,41.92 13.65,42.5 | RN4.3 14.22,41.93 14.22,41.92 | RN3.6 14.4,38.9 14.05,38.9 v13.65,38.5 | v13.65,38.5 13.3,38.15 13.3,37.73 RN3.4 | J5.5 15.27,67.27 v15.3,67.3 | RN4.4 13.67,42.5 13.65,42.5 | C22.1 12.3,52.15 v12,52.15 | RN5.14 9.9,37 9.9,37.5 | 7.6,39.87 8.03,39.87 8.65,39.25 v8.65,39.15 | 9.9,37.5 9.9,38 9.28,38.62 9.26,38.62 | RN5.12 9.26,38.62 | RN5.13 9.27,37.5 9.9,37.5 | RN5.10 7.6,39.23 7.6,39.87 | RN5.11 v8.65,39.15 | v8.65,39.15 8.73,39.15 9.26,38.62 | RN4.8 11.75,45.11 11.75,44.4 11.95,44.2 | 12.5,43.65 11.95,44.2 | RN4.9 12.5,47.3 C2.2 | C17.2 4.8,46.44 U6.2 v4.8,50.4 4.75,50.45 C19.2 v4.75,53.55
  Bottom 0.3: v12.75,67.3 13.94,67.3
  Bottom 0.4: C24.2 15.65,18.1 14.75,17.2 13.73,17.2 13.1,16.57 C16.2
  Bottom 0.5: 13.47,14.13 J7.GND5 | 14.09,7.83 J7.6
  Bottom 0.55: 13.47,14.13 13.1,14.5 | J7.GND6 10.1,14.75 v10,14.85
  Bottom 0.6: J7.GND1 6.8,10.85 v6.8,11.8 J7.GND2 8.19,14.85 v8.6,14.85 v9.3,14.85 v10,14.85 v10.7,14.85 10.95,15.1 C16.2 13.1,14.5 | J7.GND4 J7.GND3 17.47,13.82 v17.65,14
  other vias: 3.2,15.7 5.15,21.1 5.15,20.5 10.05,18.55 10.05,19.15 3.9,6.5 22.2,12.65 15.5,46.65 15.9,56.6 15.9,55.55 15.95,54.2
  pour Top (no thermals): 10.85,28.63 10.85,29.97 10.9,30.02 11.15,30.02 11.22,29.95 11.22,28.63
  pour Route15 (isolate 0.3, rank 2): 0,0 22.9,0 22.9,68.6 0,68.6
  pour Route2 (isolate 0.3, rank 2): 0,0 22.9,0 22.9,68.6 0,68.6
  pour Bottom (no thermals): 10.65,32.9 12.15,32.9 12.3,32.75 12.3,32.1 11.15,30.95 10.8,30.95 10.5,31.25 10.5,32.75
  pour Bottom (no thermals): 3.8,12.8 3.8,17.25 3.61,17.44 3.61,19.19 3.2,19.6 3.2,20.45 3.35,20.6 4.25,20.6 4.4,20.45 4.4,19.65 4.85,19.65 5.5,20.3 5.5,21.2 5.3,21.4 3.85,21.4 3.7,21.55 3.7,22.3 3.4,22.3 3.4,21.7 2.9,21.2 2.9,19.5 3,19.4 3,17.4 3.2,17.2 3.2,16.05 2.95,15.8 2.2,15.8 2,16 1.3,16 1.25,15.95 1.25,15.45 1.3,15.4 2.4,15.4 3.2,14.6 3.2,12.85 3.25,12.8
  pour Bottom (no thermals): 7.2,16.65 7.2,17.4 9.3,19.5 10.25,19.5 10.5,19.25 10.5,17.55 10.68,17.37 12.03,17.37 12.1,17.3 12.1,16.88 12.04,16.82 10.93,16.82 10.85,16.9 7.76,16.9 7.47,16.61 7.24,16.61
GND_1
  cutout Route14 (rank 2): 11.45,30.05 11.22,30.27 12.85,31.9 13.25,31.5 15.25,31.5 18.62,28.12 14.68,24.18 11.45,27.4
GND_2
  cutout Route15 (rank 2): 11.45,30.05 11.22,30.27 12.85,31.9 13.25,31.5 15.25,31.5 18.62,28.12 14.68,24.18 11.45,27.4
GND_3
  cutout Route2 (rank 2): 11.45,30.05 11.22,30.27 12.85,31.9 13.25,31.5 15.25,31.5 18.62,28.12 14.68,24.18 11.45,27.4
GND_4
  cutout Route14 (rank 2): 9.18,31.93 10.82,30.27 10.6,30.05 10.6,27.7 7.35,24.45 3.35,28.45 6.4,31.5 8.75,31.5
GND_5
  cutout Route15 (rank 2): 9.18,31.93 10.82,30.27 10.6,30.05 10.6,27.7 7.35,24.45 3.35,28.45 6.4,31.5 8.75,31.5
GND_6
  cutout Route2 (rank 2): 9.18,31.93 10.82,30.27 10.6,30.05 10.6,27.7 7.35,24.45 3.35,28.45 6.4,31.5 8.75,31.5
GND_24  (via drill 0.2)
  Top 0.5: 11.85,29.45 11.85,28.92 SUPPLYTIE3.P$2 11.85,28.82 11.85,28.16
  other vias: 11.75,30.25 12.9,31.35 16.45,26.55 18,28.2 14.7,24.9 11.85,27.9 15.15,31.1
  pour Top (no thermals): 11.38,30.27 11.82,30.73 12.1,30.45 12.1,27.85 14.72,25.23 17.7,28.2 15,30.9 12.8,30.9 12.43,31.27 12.88,31.73 13.2,31.4 15.2,31.4 18.45,28.15 14.68,24.38 11.6,27.46 11.6,30.05
  pour Bottom (no thermals): 11.45,27.4 11.45,30.05 11.22,30.27 12.85,31.9 13.25,31.5 15.25,31.5 18.62,28.12 14.68,24.18
  cutout Route3 (rank 2): 11.45,30.05 11.22,30.27 12.85,31.9 13.25,31.5 15.25,31.5 18.62,28.12 14.68,24.18 11.45,27.4
GND_32  (via drill 0.2)
  Top 0.5: 10.23,29.6 10.23,28.9 SUPPLYTIE2.P$1 10.23,28.84 10.23,28.27
  other vias: 9.15,31.4 10.35,30.25 8.9,30 8.2,30 8.9,29.3 5.7,26.8 4,28.5 7.4,25.2 10.2,27.9 6.6,31.15
  pour Top (no thermals): 9.16,31.77 9.53,31.41 9.2,31.08 6.88,31.08 4.4,28.6 7.43,25.57 9.98,28.12 9.98,30.25 10.36,30.63 10.72,30.27 10.48,30.03 10.48,27.78 7.35,24.65 3.55,28.45 6.5,31.4 8.8,31.4
  pour Top (no thermals): 7.23,29.45 8.2,30.42 9.1,30.42 9.33,30.19 9.33,29.31 8.35,28.33
  pour Bottom (no thermals): 9.18,31.93 10.82,30.27 10.6,30.05 10.6,27.7 7.35,24.45 3.35,28.45 6.4,31.5 8.75,31.5
  cutout Route3 (rank 2): 9.18,31.93 10.82,30.27 10.6,30.05 10.6,27.7 7.35,24.45 3.35,28.45 6.4,31.5 8.75,31.5
GPIO0/!CS!/D0  (via drill 0.2)
  Top 0.15: v15.45,49.1 15.45,48.07 U1.55
  Route3 0.15: v11.05,43.3 11.35,43.6 11.6,43.6 15.45,47.45 v15.45,49.1
  Route14 0.15: J2.9 2.12,32.6 8.6,32.6 9.65,33.65 9.65,34.35 5.85,38.15 5.85,40.98 8.42,43.55 10.03,43.55 10.28,43.3 v11.05,43.3
GPIO1/D1  (via drill 0.2)
  Top 0.15: U1.7 8.43,33.87 v8.4,33.9
  Bottom 0.15: v8.4,33.9 8.4,33.52 7.29,32.41 6.06,32.41 5.62,31.97 3.59,31.97 J2.8
GPIO2/D2  (via drill 0.2)
  Top 0.15: U1.6 7.93,34.03 v7.82,34.14
  Bottom 0.15: J2.7 2.65,35.45 2.65,33.52 3.86,32.31 5.46,32.31 5.86,32.71 6.83,32.71 7.82,33.71 v7.82,34.14
GPIO3/D3  (via drill 0.2)
  Top 0.15: U1.5 7.43,33.91 v7.2,34.14
  Bottom 0.15: v7.2,34.14 7.18,34.12 7.18,33.77 6.41,33 5.55,33 5.2,32.65 4.17,32.65 3.1,33.72 3.1,36.81 2.62,37.29 2.62,38.02 J2.6
GPIO4/D4  (via drill 0.2)
  Top 0.15: U1.4 6.93,33.67 v6.6,34
  Route14 0.15: v6.6,34 | v6.6,34 6.17,33.57 5.72,33.57 5.47,33.82 5.47,35.73 4.35,36.85 3.7,36.85 3.2,37.35 3.2,39.98 J2.5
GPIO5/D5  (via drill 0.2)
  Top 0.15: U1.3 6.43,33.47 v5.9,34
  Route14 0.15: J2.4 2.22,44.45 2.52,44.15 2.83,44.15 3.2,43.78 3.2,40.72 3.44,40.48 3.44,37.91 3.75,37.6 4.35,37.6 5.9,36.05 v5.9,34
GPIO6/D6  (via drill 0.2)
  Top 0.15: v19.95,37.75 19.95,37.45 19.8,37.3 19.8,36.8 19.5,36.5 U1.30
  Route14 0.15: J2.3 2.73,48.45 11.4,48.45 17.3,42.55 17.85,42.55 18.9,41.5 18.9,40.3 19.8,39.4 19.8,38.75 19.95,38.6 v19.95,37.75
N$1
  Bottom 0.15: R9.1 3.1,12.1 2.6,12.1 2.24,12.46 2.24,12.92 1.88,13.28 1.42,13.28 0.9,13.8 0.9,19.8 1.49,20.39 CHG.2
N$2  (via drill 0.2)
  Top 0.15: v2.55,19.2 3.3,19.2 4.55,17.95 10.39,17.95 D5.A
  Bottom 0.15: v2.55,19.2 2.55,21.45 1.82,22.18 CHG.1
N$3  (via drill 0.2)
  Top 0.15: D5.C 10.4,17.6 4.35,17.6 4.25,17.7 v2.55,17.7
  Bottom 0.15: v2.55,17.7 U3.1
  Bottom 0.2: v2.55,17.7
N$4
  Bottom 0.15: R13.2 Q2.1
N$5
  Bottom 0.15: U3.5 2.09,14.11 R11.2
N$6  (via drill 0.2)
  Top 0.2: v1.3,59 1.3,59.88 D2.C
  Bottom 0.2: R5.2 v1.3,59
N$7  (via drill 0.2)
  Top 0.15: U1.92 5.45,38.5 6.75,39.8 8.4,39.8 8.95,40.35 8.95,40.8 8.6,41.15 8.25,41.15 7.6,41.8 7.6,42.35 6.65,43.3 v5.13,43.3
  Bottom 0.15: RN1.9 5.43,42.81 5.43,42.9 5.13,43.2 v5.13,43.3
N$8  (via drill 0.2)
  Top 0.15: v17.78,39.05 18.23,39.5 U1.36
  Bottom 0.15: RN3.9 17.18,38.46 v17.78,39.05
N$9  (via drill 0.2)
  Route3 0.12: v1.7,12.75 2.7,13.75 10.4,13.75 15.25,18.6 15.25,20.9 19.14,24.79 19.14,29.16 14.95,33.35 12.5,33.35 11.46,34.39 11.46,35.51 14.55,38.6 v14.55,39.85
  Bottom 0.15: R1.1 3,11.2 2.6,11.2 C1.2 2,11.7 1.7,12 v1.7,12.75 | RN3.7 14.58,39.85 v14.55,39.85
N$10
  Bottom 0.15: I2C.1 1.5,10.3 R6.2
N$11
  Bottom 0.15: I2C.3 1.5,6.5 R7.2
N$13  (via drill 0.2)
  Top 0.12: v13.3,35.65 13.93,35.02 U1.18
  Bottom 0.12: v13.3,35.65 14.25,35.65 RN3.14
N$14
  Bottom 0.2: R12.1 1.32,63.72 JP4.2
N$15  (via drill 0.2)
  Top 0.12: U1.25 17.43,33.61 v17.22,33.82 17.22,34.83 15.92,36.13 15.92,38.27 v16.6,38.95
  Bottom 0.12: v16.6,38.95 16.2,38.55 16.2,38.23 RN3.10 | v17.22,33.82 17.22,34.12 17.35,34.25 R2.2
N$16  (via drill 0.2)
  Top 0.2: D6.C 1.3,62.58 v1.3,61.65
  Bottom 0.2: v1.3,61.65 R12.2
N$17  (via drill 0.2)
  Top 0.15: U1.61 12.43,48.65 12.6,48.82 12.6,50 12.15,50.45 v12.15,51
  Bottom 0.15: RN1.14 7.8,46.1 7.8,46.79 9.78,48.77 9.78,49.88 10.9,51 v12.15,51
N$18  (via drill 0.2)
  Top 0.15: U1.60 12.93,50.32 v12.7,50.55
  Bottom 0.15: RN1.15 8.5,46.53 8.5,47.15 10.02,48.67 10.02,49.67 10.9,50.55 v12.7,50.55
N$19  (via drill 0.3)
  Top 0.3: J1.SHLD1 J1.SHLD6 J1.SHLD8 J1.SHLD2
  Bottom 0.3: J1.SHLD2 19.48,5.28 20.02,5.82 SHLD.2
  other vias: 7.11,5.28 15.75,5.28 15.75,1.1 7.11,1.1
N$20  (via drill 0.2)
  Top 0.15: J1.B5 13.18,5.41 12.75,4.98 12.75,3.97 13.17,3.55 v14.8,3.55 | v16.65,3.55 17.2,4.1 R3.2
  Bottom 0.15: v16.65,3.55 v14.8,3.55
N$21  (via drill 0.2)
  Top 0.15: R4.2 v6.25,3.95 | J1.A5 10.18,5.26 10.02,5.1 10.02,3.87 9.75,3.6 9.15,3.6 8.8,3.95 v8,3.95
  Bottom 0.15: v8,3.95 v6.25,3.95
N$22  (via drill 0.2)
  Top 0.15: U1.59 13.43,49.77 v13.4,49.8
  Bottom 0.15: v13.4,49.8 12.5,49.8 12.05,50.25 11.04,50.25 10.3,49.51 10.3,48.61 9.15,47.46 9.15,47.01 RN1.16
N$23  (via drill 0.2)
  Top 0.15: v17.62,43.89 v17.62,43.88 17.62,43.28 17.9,43 U1.43
  Bottom 0.15: RN4.15 17.32,43.89 v17.61,43.89 v17.62,43.89
N$24  (via drill 0.2)
  Top 0.15: U1.67 9.43,48.92 v9.35,49
  Bottom 0.15: RN1.13 7.35,45.42 7.35,47.05 9.3,49 v9.35,49
N$26  (via drill 0.2)
  Top 0.12: v13.75,36.1 14.2,35.65 14.2,35.28 14.43,35.05 U1.19
  Bottom 0.12: v13.75,36.1 13.85,36.1 14.05,36.3 14.73,36.3 RN3.13
N$27  (via drill 0.2)
  Top 0.12: v14.35,36.71 14.35,36.36 14.55,36.16 14.55,35.42 14.93,35.05 U1.20
  Bottom 0.12: RN3.12 15.34,36.83 14.62,36.83 14.5,36.71 v14.35,36.71
N$28  (via drill 0.2)
  Top 0.12: U1.21 15.43,35.02 14.9,35.55 v14.9,37.25
  Bottom 0.12: RN3.11 15.8,37.5 15.15,37.5 v14.9,37.25
N$29  (via drill 0.3)
  Top 0.2: U1.87 4.9,41 5.85,40.05 5.85,39.45 5.4,39 U1.91 v2.65,39
  Bottom 0.2: FB2.1 C27.1 C26.1 2.95,39.95 2.65,39.65 v2.65,39
N$30  (via drill 0.2)
  Top 0.15: U1.41 18.07,42 16.75,43.32 v16.75,44.75
  Bottom 0.15: v16.75,44.75 15.92,44.75 RN4.13
N$31  (via drill 0.2)
  Top 0.15: v17.3,45 17.3,45.3 17.7,45.7 18.13,45.7 18.33,45.5 U1.48
  Bottom 0.15: RN4.12 15.33,45.3 17,45.3 v17.3,45
N$32  (via drill 0.2)
  Top 0.15: U1.42 18.01,42.5 17.15,43.36 17.15,44.3 v17.2,44.35
  Bottom 0.15: v17.2,44.35 17.12,44.27 16.57,44.27 RN4.14
N$33  (via drill 0.3)
  Top 0.2: U1.8 8.93,32.25 8.6,31.92 v8.5,31.92
  Bottom 0.2: v8.5,31.92 6.19,31.92 3.12,28.86 3.12,28.12 7.05,24.2 BAT.2
N$35  (via drill 0.2)
  Top 0.15: U1.57 14.43,47.29 v14.22,47.08
  Bottom 0.15: v14.22,47.08 14.22,46.45 RN4.10
N$36  (via drill 0.2)
  Top 0.15: v14.95,46.05 14.93,46.07 U1.56
  Bottom 0.15: RN4.11 v14.95,46.05
N$37  (via drill 0.2)
  Top 0.15: U1.68 8.9,48.08 8.9,49.18 9.2,49.48 v9.2,49.9
  Bottom 0.15: RN1.12 6.9,44.73 6.9,47.16 9.2,49.46 v9.2,49.9
N$41  (via drill 0.2)
  Top 0.15: U1.93 4.83,38 v5.13,37.7
  Bottom 0.15: v5.13,37.7 5.62,38.19 RN5.8
N$42  (via drill 0.2)
  Top 0.15: U1.94 4.72,37.5 4.95,37.27 5.52,37.27 v5.55,37.3
  Bottom 0.15: v5.55,37.3 5.6,37.3 6.11,37.81 RN5.7
N$43  (via drill 0.2)
  Top 0.15: U1.95 5.24,37 5.39,36.85 v5.95,36.85
  Bottom 0.15: v5.95,36.85 6.35,36.85 RN5.6
N$44  (via drill 0.2)
  Top 0.15: U1.96 5.24,36.5 5.34,36.4 v6.35,36.4
  Bottom 0.15: v6.35,36.4 6.83,36.4 7.12,36.68 RN5.5
N$45  (via drill 0.2)
  Top 0.15: U1.97 6.15,36 6.2,35.95 v6.75,35.95
  Bottom 0.15: v6.75,35.95 7.72,35.95 RN5.4
N$46  (via drill 0.2)
  Top 0.15: U1.98 7.15,35.5 v7.2,35.45
  Bottom 0.15: v7.2,35.45 7.25,35.4 8.3,35.4 RN5.3
N$47
  Top 0.15: R15.2 Q1.1
N$97  (via drill 0.3)
  Top 0.2: v10.8,34.65 10.1,34.65 9.43,33.98 U1.9
  Bottom 0.2: C11.1 v10.8,34.65
N$98  (via drill 0.3)
  Top 0.2: v10.8,49.05 10.93,48.92 U1.64
  Bottom 0.2: v10.8,49.05 C12.1
QIO0  (via drill 0.2)
  Top 0.15: U1.73 6.42,49.21 7.16,49.95 7.85,49.95 12.7,54.8 16.15,54.8 16.75,55.4 16.75,56.7 16.25,57.2 15.45,57.2 v15.1,56.85
  Bottom 0.15: v15.1,56.85 14.65,56.85 14.5,56.7 U5.5
QIO1  (via drill 0.2)
  Top 0.15: U1.74 5.93,49.33 7.05,50.45 v7.4,50.45
  Bottom 0.15: U5.2 8.02,54.16 7.4,53.55 v7.4,50.45
QIO2  (via drill 0.2)
  Top 0.15: U1.71 7.43,49.03 v7.45,49.05
  Bottom 0.15: v7.45,49.05 6.85,49.65 6.85,54.65 7.63,55.44 U5.3
QIO3  (via drill 0.2)
  Top 0.15: U1.72 6.93,49.23 7.3,49.6 8.05,49.6 12.65,54.2 v15.1,54.2
  Bottom 0.15: v15.1,54.2 15.06,54.16 U5.7
QSPCLK  (via drill 0.2)
  Top 0.15: U1.75 5.43,49.48 7,51.05 8.3,51.05 12.75,55.5 v15.1,55.5
  Bottom 0.15: U5.6 15.04,55.44 v15.1,55.5
RA6_SWCLK/TCK  (via drill 0.2)
  Top 0.15: v19.6,47 19.18,47 18.98,46.8 U1.50
  Bottom 0.15: v19.6,47 19.6,48.97 J4.3
RA6_SWDIO/TMS  (via drill 0.2)
  Top 0.15: U1.51 17.43,49.42 v17.25,49.6
  Bottom 0.15: J4.2 17.25,51.32 v17.25,49.6
RA6_SWO/TDO/PICO/D18  (via drill 0.2)
  Top 0.15: v16.9,49.05 16.93,49.02 U1.52
  Bottom 0.15: J2.17 20.7,42.8 20.7,43.6 20.35,43.95 20.35,44.69 19.57,45.46 19.57,46.33 19.1,46.8 19.1,47.3 19.25,47.45 19.25,48.07 18.27,49.05 v16.9,49.05 15.75,50.2 15.75,50.28 J4.4
RA6_TDI/POCI/D17  (via drill 0.2)
  Top 0.15: U1.53 16.43,49.78 17.1,50.45 19.3,50.45 v19.75,50
  Bottom 0.15: J2.16 21.14,44.45 20.05,45.54 20.05,48.99 19.75,49.29 v19.75,50
RGB_DIN  (via drill 0.2)
  Top 0.15: U1.70 7.93,48.83 v8.15,49.05 | v2.2,59.1 2.2,63.94 D4.DI
  Route3 0.15: v8.15,49.05 8.15,50.85 8.7,51.4 8.7,53.2 2.8,59.1 v2.2,59.1
RGB_DOUT  (via drill 0.2)
  Top 0.15: D4.DO 3.54,67.3 v3.55,67.3
  Bottom 0.15: TP1.1 | v3.55,67.3 TP1.1
RX_RA6/TX_DA14531  (via drill 0.2)
  Top 0.15: v5.7,59.55 5.68,59.57 U2.5 | U1.66 9.93,50.22 v9.7,50.45
  Route3 0.15: v9.7,50.45 9.7,55.55 v5.7,59.55
  Bottom 0.15: v5.7,59.55 5.7,60.31 TP6.1
SCK/D19  (via drill 0.2)
  Top 0.15: J2.18 20.73,40.23 20.73,40.83 20.3,41.26 20.3,42.22 20.55,42.47 20.55,43.53 20.36,43.72 20.36,45.12 v20.85,45.6 | v19.2,51.3 17.05,51.3 15.93,50.18 U1.54
  Bottom 0.15: v20.85,45.6 20.35,46.1 20.35,49.13 20.2,49.28 20.2,50.3 v19.2,51.3
SCL/D16  (via drill 0.2)
  Top 0.15: J3.4 v3.9,7.4 3.2,7.4 2,8.6 2,9.54 4.13,11.67 4.13,15.57 3.35,16.35 1.81,16.35 1.2,16.96 1.2,19.09 2.16,20.05 3.8,20.05 4.05,20.3 v4.05,23 | v3.9,31.25 4.55,31.25 5.43,32.13 U1.1
  Route3 0.15: J2.2 3.85,46.95 3.85,31.65 3.9,31.6 v3.9,31.25
  Bottom 0.15: R7.1 3.4,7.4 v3.9,7.4 | U7.7 v4.05,23 4.05,26.25 2.5,27.8 2.5,29.86 v3.9,31.25
SDA/D15  (via drill 0.2)
  Top 0.15: J3.3 v3.9,8.4 2.8,8.4 2.45,8.75 2.45,9.35 4.58,11.48 4.58,15.76 3.54,16.8 2,16.8 1.65,17.15 1.65,18.95 2.35,19.65 4.04,19.65 4.55,20.16 v4.55,22.7 | U1.2 5.93,32.08 4.67,30.82 v4.33,30.82
  Route3 0.15: J2.1 4.18,49.16 4.18,31.82 4.33,31.67 v4.33,30.82
  Bottom 0.15: v3.9,8.4 3.9,9.3 2.5,10.7 R6.1 | U7.8 v4.55,22.7 4.55,26.15 2.75,27.95 2.75,29.23 v4.33,30.82
SDCLK  (via drill 0.2)
  Top 0.12: v18.1,37.75 18.1,37.77 18.33,38 U1.33
  Bottom 0.12: v18.1,37.75 18.1,36.93 15.29,34.12 15.29,33.67 19.97,28.99 19.97,26.12 18.8,24.95 18.8,8.4 18.35,7.95 15.35,7.95 14.9,8.4 13.4,8.4 12.99,7.99 J7.5
SDCMD  (via drill 0.2)
  Top 0.12: U1.34 v18.05,38.5
  Bottom 0.12: v18.05,38.5 18.05,38.31 17.64,37.9 17.64,37.6 17.76,37.47 17.76,36.94 15.03,34.21 15.03,33.63 19.76,28.9 19.76,26.56 18.25,25.05 18.25,8.4 18.1,8.24 15.51,8.24 15.1,8.65 11.35,8.65 10.79,8.09 J7.3
SDDAT0  (via drill 0.2)
  Top 0.12: v19.85,40 U1.37
  Bottom 0.12: v19.85,40 18.65,38.8 18.65,37.19 15.55,34.09 15.55,33.7 20.18,29.07 20.18,25.63 19.35,24.8 19.35,8.4 18.59,7.64 15.34,7.64 15.19,7.49 J7.7
SDDAT1  (via drill 0.2)
  Top 0.12: U1.22 15.93,33.58 16.01,33.66 v16.01,33.86
  Bottom 0.12: v16.01,33.86 16.06,33.81 16.06,33.54 20.39,29.21 20.39,25.14 19.9,24.65 19.9,8.4 18.83,7.33 17.23,7.33 16.79,6.89 J7.8
SDDAT2  (via drill 0.2)
  Top 0.12: U1.31 18.33,37 18.18,36.85 17.15,36.85 17,37 v16.85,37
  Bottom 0.12: v16.85,37 16.6,36.75 16.6,36.47 14.51,34.38 14.51,33.55 19.34,28.73 19.34,27.55 17.15,25.36 17.15,14.9 15.75,13.5 8,13.5 7.58,13.08 7.58,8.57 8.59,7.56 J7.1
SDDAT3  (via drill 0.2)
  Top 0.12: U1.32 18.55,37.5 18.35,37.3 v17.35,37.3
  Bottom 0.12: v17.35,37.3 17.35,36.88 14.77,34.3 14.77,33.59 19.55,28.81 19.55,27.03 17.75,25.23 17.75,14.91 15.89,13.05 8.33,13.05 7.98,12.7 7.98,8.72 8.35,8.35 9.2,8.35 9.69,7.86 J7.2
SDDET  (via drill 0.2)
  Top 0.12: v20.28,38.9 19.73,38.9 19.63,39 U1.35
  Route3 0.15: v6.65,7.5 14.05,14.9 14.05,15.6 20,21.55 20,30.35 v18.85,31.5
  Bottom 0.12: v20.28,38.9 20.28,38.05 20.43,37.9 20.43,36.38 20.79,36.02 20.79,35.28 20.2,34.69 20.2,32.85 v18.85,31.5
  Bottom 0.2: J7.9 6.84,9.52 6.84,8.49 6.65,8.3 v6.65,7.5
STAT_LED  (via drill 0.2)
  Top 0.15: U1.69 8.45,48.07 8.45,48.73 8.65,48.93 v8.65,49.55 | D2.A 3.65,59.33 v3.65,59
  Route3 0.15: v8.65,49.55 8.65,50.75 9.25,51.35 9.25,54 4.25,59 v3.65,59
TX_RA6/RX_DA14531  (via drill 0.2)
  Top 0.15: v19.25,63.7 17.2,63.7 U2.14 | U1.65 10.43,48.69 10.3,48.82 v10.3,51.1
  Route3 0.2: v19.25,63.7 12.75,63.7 10.3,61.25 v10.3,51.1
  Bottom 0.15: TP5.1 v19.25,63.7
UART_RX/D21  (via drill 0.2)
  Top 0.15: U1.24 16.93,33.45 16.78,33.6 16.78,34.67 15.65,35.8 15.65,44.4 v17.05,45.8
  Route14 0.15: v17.05,45.8 20.4,45.8 J2.15
UART_TX/D20  (via drill 0.2)
  Top 0.15: U1.23 16.43,33.42 16.44,33.43 16.44,34.51 15.35,35.6 15.35,44.8 v16.35,45.8
  Route14 0.15: J2.14 19.69,47.63 18.18,47.63 v16.35,45.8
USBD_N
  Top 0.16: D1.4 11.93,9.58 12.13,9.78 12.13,10.53 11.62,11.04 11.62,11.47 12.3,12.15 18.26,12.15 19.88,13.77 19.88,32.55 18.13,34.3 18.13,34.7 18.43,35 U1.27
USBD_P
  Top 0.16: D1.6 10.93,9.58 10.73,9.78 10.73,10.53 11.24,11.04 11.24,11.63 12.14,12.53 18.1,12.53 19.5,13.93 19.5,32.4 17.75,34.15 17.75,34.86 18.39,35.5 U1.28
USBIN_N  (via drill 0.2)
  Top 0.16: J1.B7 10.68,5.21 10.63,5.16 v10.63,4.8 | v11.73,4.8 11.73,5.21 11.68,5.26 J1.A7 11.68,7.18 12.03,7.53 12.03,8.22 11.93,8.32 D1.3
  Bottom 0.16: v11.73,4.8 v10.63,4.8
USBIN_P
  Top 0.16: J1.B6 12.18,5.16 12.28,5.06 12.28,4.58 11.97,4.27 11.48,4.27 11.18,4.57 11.18,5.21 J1.A6 11.18,7.17 10.83,7.52 10.83,8.24 10.93,8.35 D1.1
V_BATT  (via drill 0.3)
  Top 0.5: J2.12 4.12,24.13 6.05,22.2 v6.05,19.7
  other vias: 6.85,19.7 7.65,19.7 8.45,19.7
  pour Bottom (isolate 0.15, rank 2, no thermals): 4.14,20.36 3.46,20.36 3.4,20.3 3.4,19.7 4,19.1 4,17.45 4.2,17.25 4.2,16.15 4.7,16.15 4.7,17.1 5.1,17.5 6.55,17.5 6.7,17.35 6.7,16.65 7,16.65 7,17.6 8.9,19.5 8.9,19.9 8.75,20.05 5.75,20.05 5,19.3 4.45,19.3 4.2,19.55 4.2,20.3
  pour Top (isolate 0.15, rank 2, no thermals): 4.95,19.45 5.8,20.3 6.3,20.3 6.55,20.05 8.75,20.05 9.55,19.25 9.55,18.3 5,18.3 4.95,18.35
V_USB  (via drill 0.3)
  Top 0.25: v11.43,10.25 D1.5
  Top 0.6: v5.95,14.6 7,15.65 11.75,15.65 12.35,16.25 12.35,19.65 10.35,21.65 8.93,21.65 1.37,29.21 J2.10
  Route3 0.25: v13.45,4.85 13.38,4.85 12.73,5.5 12.73,8.95 v11.43,10.25
  other vias: 9.45,4.25 9.45,4.85 13.45,4.25
  pour Top (isolate 0.15, rank 2, no thermals): 9.27,6.3 9.27,5.33 9.45,5.15 9.6,5.15 9.9,4.85 9.9,4 9.65,3.75 9.25,3.75 9.05,3.95 9.05,4.95 8.7,5.3 8.7,6.3
  pour Top (isolate 0.15, rank 2, no thermals): 13.6,6.35 13.6,5.3 13.45,5.15 13.25,5.15 13.1,5 13.1,4.1 13.28,3.92 13.57,3.92 13.8,4.15 13.8,4.95 14.15,5.3 14.15,6.35
  pour Bottom (isolate 0.15, rank 2, no thermals): 9.05,4.95 9.25,5.15 9.6,5.15 10.55,4.2 11.75,4.2 12.7,5.15 13.6,5.15 13.8,4.95 13.8,4.2 11.7,2.1 5.3,2.1 4.4,3 4.4,8.65 4.15,8.9 4.15,14.65 4.4,14.9 6.55,14.9 6.7,15.05 6.7,15.75 7,15.75 7,14.55 6.85,14.4 6.25,14.4 5.75,13.9 5.75,3.8 6.05,3.5 8.3,3.5 9.05,4.25
VIN  (via drill 0.3)
  Route3 0.2: v11.45,42.35 11.45,37.5 10,36.05 10,34.3 11.45,32.85 14.79,32.85 18.78,28.86 18.78,25.63 v13.3,20.15
  Route14 0.2: v6.1,44.45 6.7,45.05 10.5,45.05 12,43.55 12,42.9 v11.45,42.35
  Bottom 0.2: U6.1 5.75,46.91 | C17.1 5.85,46.35 6.1,46.11 v6.1,44.45 | v13.3,20.15 R10.2
  Bottom 0.3: 5.75,46.91 C17.1
  Bottom 0.35: R10.2 13.3,18.7 12.5,17.9 12.5,16.7 11.95,16.15 U4.1
  pour Bottom (isolate 0.15, rank 2, no thermals): 6.45,17.25 6.25,17.25 6.2,17.2 6.2,15.2 6.25,15.15 6.45,15.15 6.5,15.2 6.5,15.85 6.65,16 7.55,16 7.75,15.8 10.9,15.8 11,15.9 12.05,15.9 12.1,15.95 12.1,16.3 12,16.4 10.95,16.4 10.75,16.6 7.75,16.6 7.55,16.4 6.65,16.4 6.5,16.55 6.5,17.2
VREF1  (via drill 0.3)
  Route3 0.2: v5.75,54.05 5.75,45.7 9.25,42.2 9.25,33.85 8.7,33.3 v4.8,33.3 4.86,33.24 4.86,30.56 3.25,28.95 3.25,28 7.9,23.35 v8.9,23.35
  Route14 0.2: J2.26 13.2,19.05 v8.9,23.35
  Bottom 0.2: U6.5 C19.1 v5.75,54.05 | FB2.2 4.4,37.2 4.8,36.8 v4.8,33.3
VREFEN  (via drill 0.2)
  Top 0.15: v8.55,41.95 8.55,43.8 5.85,46.5 U1.76
  Top 0.2: U1.76 3.13,46.5 2.93,46.7 v2.9,46.7
  Bottom 0.2: U6.3 3.85,45.76 TP2.1 3.81,45.79 v2.9,46.7 | RN1.6 v8.55,41.95
VREG_EN  (via drill 0.2)
  Route3 0.15: J2.11 2.5,25.44 2.5,20.4 3.9,19 8.9,19 9.65,19.75 v11.1,19.75
  Bottom 0.15: R10.1 11.75,19.75 v11.1,19.75
  Bottom 0.2: U4.3 11.85,18.05 12.3,18.5 R10.1
XCIN
  Top 0.15: U1.10 9.93,31.28 9.35,30.7 7.49,30.7 C10.2 6.65,29.85 6.65,29.51 Y2.P$1
XCOUT
  Top 0.15: U1.11 10.43,31.23 9.6,30.4 9.6,28.59 C9.2 8.75,27.75 8.41,27.75 Y2.P$2
XTAL
  Top 0.15: U1.13 11.43,31.43 14.89,27.97 14.89,26.66 Y1.3

## Text on the board
Top: 1
Route2: 2
Route3: 3
Route14: 4
Route15: 5
Bottom: 6 | v10
Measures: All Units in Inches
tDocu: Layers: 6 / Stackup: JLC06161H-3313 / Material: TG155 / Outer Layers: 1oz / Inner Layers: 0.5oz / Board thickness: 1.6mm / Via Covering: Epoxy Filled & Capped / Soldermask: Red / Silkscreen: White / Surface Finish: ENIG | Alex Brudner